# EAGLE design tinyisp-v0.9 (EAGLE 6.3)
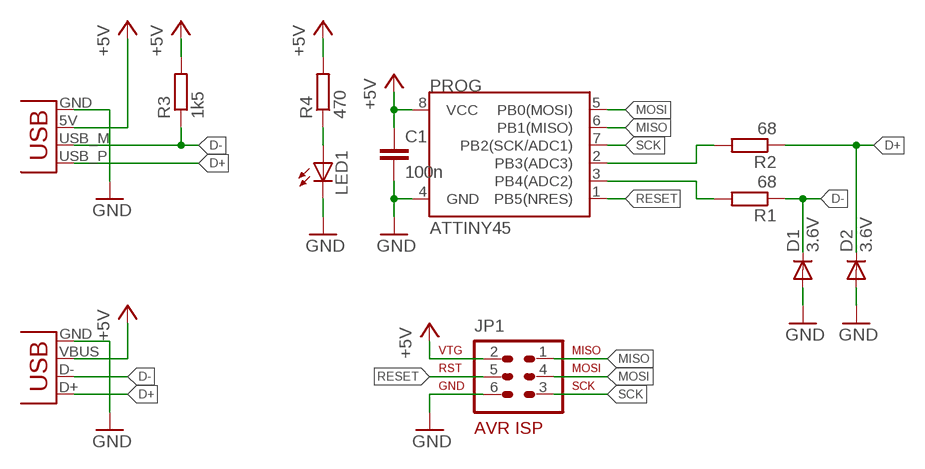
[diagram p0: schematic, sheet 1]

## Parts
C1  100n  C-EUC0805  [C0805]
D1  3.6V  DIODE-MINIMELF  [MINIMELF]
D2  3.6V  DIODE-MINIMELF  [MINIMELF]
JP1  AVR-ISP-6  [AVR-ISP-6]
LED1  LEDCHIP-LED0805  [CHIP-LED0805]
PROG  ATTINY45  [SO08-EIAJ]
R1  68  R-EU_R0805  [R0805]
R2  68  R-EU_R0805  [R0805]
R3  1k5  R-EU_R0805  [R0805]
R4  470  R-EU_R0805  [R0805]
X1  USBPCB  [USB-A-PCB]
X2  USBMINI_B_NOHOLES  [USB_MINI_B_NOHOLES]

## Nets
+5V: C1.1 JP1.2 PROG.8(VCC) R3.2 R4.2 X1.5V(VBUS) X2.VBUS
D+: D2.C R2.1 X1.USB_P(D+) X2.D+
D-: D1.C R1.1 R3.1 X1.USB_M(D-) X2.D-
GND: C1.2 D1.A D2.A JP1.6 LED1.C PROG.4(GND) X1.GND X2.GND
MISO: JP1.1 PROG.6(PB1(MISO))
MOSI: JP1.4 PROG.5(PB0(MOSI))
N$1: LED1.A R4.1
N$8: PROG.2(PB3(ADC3)) R2.2
N$9: PROG.3(PB4(ADC2)) R1.2
RESET: JP1.5 PROG.1(PB5(NRES))
SCK: JP1.3 PROG.7(PB2(SCK/ADC1))

## Library data of the parts
C1 = rcl:C-EU: CAPACITOR, European symbol
D1 D2 = diode:DIODE-: DIODE
JP1 = avr-6:AVR-ISP-6: AVR ISP-6 Serial Programming Header
LED1 = led:LED: LED OSRAM: - CHIPLED LG R971, LG N971, LY N971, LG Q971, LY Q971, LO R971, LY R971 LH N974, LH R974 LS Q976, LO Q976, LY Q976 LO Q996 - Hyper CHIPLED LW Q18S LB Q993, LB Q99A, LB R99A - SideLED LS A670, LO A670, LY A670, LG A670, LP A670 LB A673, LV A673, LT A673, LW A673 LH A674 LY A675 LS A676, LA A676, LO A676, LY A676, LW A676 LS A679, LY A679, LG A679 - Hyper Micro SIDELED® LS Y876, LA Y876, LO Y876, LY Y876 LT Y87S - SmartLED LW L88C, LW L88S LB L89C, LB L89S, LG L890 LS L89K, LO L89K, LY L89K LS L896, LA L896, LO L896, LY L896 - TOPLED LS T670, LO T670, LY T670, LG T670, LP T670 LSG T670, LSP T670, LSY T670, LOP T670, LYG T670 LG T671, LOG T671, LSG T671 LB T673, LV T673, LT T673, LW T673 LH T674 LS T676, LA T676, LO T676, LY T676, LB T676, LH T676, LSB T676, LW T676 LB T67C, LV T67C, LT T67C, LS T67K, LO T67K, LY T67K, LW E67C LS E67B, LA E67B, LO E67B, LY E67B, LB E67C, LV E67C, LT E67C LW T67C LS T679, LY T679, LG T679 LS T770, LO T770, LY T770, LG T770, LP T770 LB T773, LV T773, LT T773, LW T773 LH T774 LS E675, LA E675, LY E675, LS T675 LS T776, LA T776, LO T776, LY T776, LB T776 LHGB T686 LT T68C, LB T68C - Hyper Mini TOPLED® LB M676 - Mini TOPLED Santana® LG M470 LS M47K, LO M47K, LY M47K Source: http://www.osram.convergy.de LUXEON: - LUMILED® LXK2-PW12-R00, LXK2-PW12-S00, LXK2-PW14-U00, LXK2-PW14-V00 LXK2-PM12-R00, LXK2-PM12-S00, LXK2-PM14-U00 LXK2-PE12-Q00, LXK2-PE12-R00, LXK2-PE12-S00, LXK2-PE14-T00, LXK2-PE14-U00 LXK2-PB12-K00, LXK2-PB12-L00, LXK2-PB12-M00, LXK2-PB14-N00, LXK2-PB14-P00, LXK2-PB14-Q00 LXK2-PR12-L00, LXK2-PR12-M00, LXK2-PR14-Q00, LXK2-PR14-R00 LXK2-PD12-Q00, LXK2-PD12-R00, LXK2-PD12-S00 LXK2-PH12-R00, LXK2-PH12-S00 LXK2-PL12-P00, LXK2-PL12-Q00, LXK2-PL12-R00 Source: www.luxeon.com KINGBRIGHT: KA-3528ASYC Source: www.kingbright.com
PROG = SparkFun:ATTINY45: Atmel ATTiny45
R1-R4 = rcl:R-EU_: RESISTOR, European symbol
X1 = SparkFun:USB: USB Connectors USB-B-PTH is fully proven SKU : PRT-00139 USB-miniB is fully proven SKU : PRT-00587 USB-A-PCB is untested. USB-A-H is throughly reviewed, but untested. Spark Fun Electronics SKU : PRT-00437 USB-B-SMT is throughly reviewed, but untested. Needs silkscreen touching up. USB-A-S has not been used/tested USB-MB-H has not been used/tested
X2 = ppeter:USB

## Board
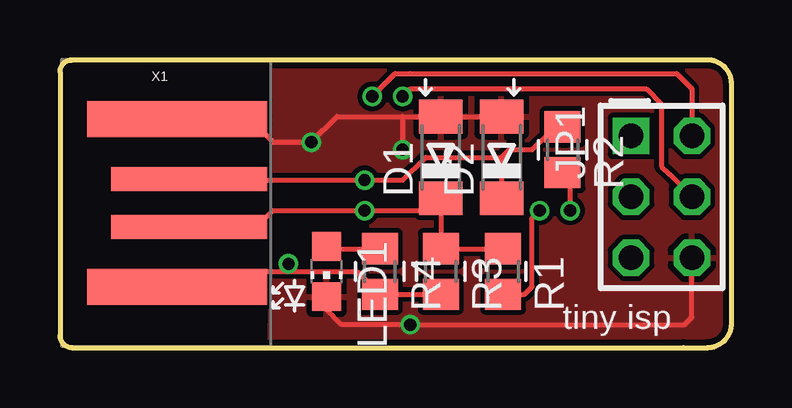
[diagram p1: board, top side]
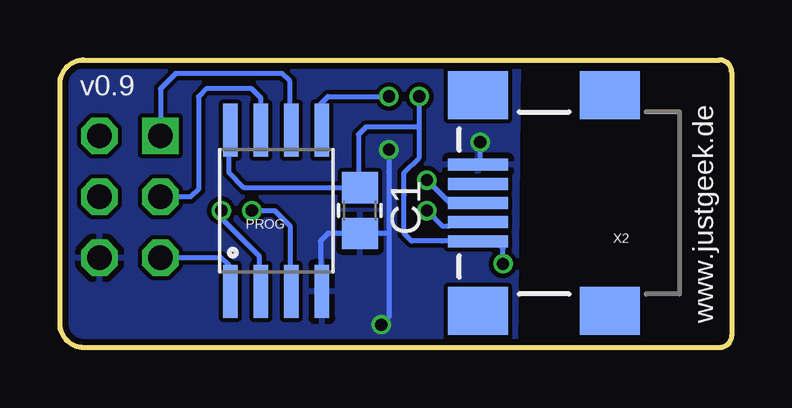
[diagram p2: board, bottom side, seen from below]

Size 28 x 12 mm. Coordinates in mm from the lower left corner, seen from the top.
Outline: 0.5,0 26,0 27,0 arc90 28,1 28,11 arc90 27,12 0.5,12 arc90 0,11.5 0,0.5 arc90 0.5,0
Copper layers (1*16): Top 0.035mm / dielectric 1.5mm / Bottom 0.035mm
Design rules "default": minimum track width 6mil, minimum drill 12mil, track to track 6mil, track to pad 6mil, pad to pad 6mil, via to via 6mil, smd to smd 0mil, copper to edge 10mil, drill to drill 10mil, minimum pad ring 10mil, minimum via ring 6mil, stop-mask expansion 2mil, vias tented up to drill 100mil, thermal gap 10mil

### Footprints (pad centres in the part's own frame; a part is rotated, then mirrored left to right if it is on the bottom)
C0805 = smd 1.3 x 1.5: 1 -0.95,0; 2 0.95,0
MINIMELF = smd 1.4 x 1.8: A 1.7,0; C -1.7,0
AVR-ISP-6 = drill 1.016 square: 1 -2.54,-1.27 | drill 1.016 octagon: 2 -2.54,1.27; 3 0,-1.27; 4 0,1.27; 5 2.54,-1.27; 6 2.54,1.27
CHIP-LED0805 = smd 1.2 x 1.2: A 0,-1.05; C 0,1.05
SO08-EIAJ = smd 0.61 x 2.21: 1 -1.905,-3.378; 2 -0.635,-3.378; 3 0.635,-3.378; 4 1.905,-3.378; 5 1.905,3.353; 6 0.635,3.353; 7 -0.635,3.353; 8 -1.905,3.353
R0805 = smd 1.3 x 1.5: 1 -0.95,0; 2 0.95,0
USB-A-PCB = smd 7.5 x 1.5: 5V -0.2,-3.5; GND -0.2,3.5 | smd 6.5 x 1: USB_M 0.3,-1; USB_P 0.3,1
USB_MINI_B_NOHOLES = smd 2.5 x 0.5: D+ 3.77,0; D- 3.77,0.8; GND 3.77,-1.6; ID 3.77,-0.8; VBUS 3.77,1.6 | smd 2.5 x 2: GND@1 -1.73,-4.5; GND@2 -1.73,4.5; GND@3 3.77,4.5; GND@4 3.77,-4.5

### Placement (x,y rotation side)
C1  15.49,5.71 270 bottom
D1  15.88,7.94 90 top
D2  18.41,7.94 90 top
JP1  25.08,6.29 270 top
LED1  11.11,3.17 180 top
PROG  18.99,5.71 0 bottom
R1  18.48,3.17 270 top
R2  20.95,8.26 270 top
R3  15.88,3.17 270 top
R4  13.34,3.17 270 top
X1  5.08,6.03 0 top
X2  6.79,6.03 180 bottom

### Tracks (layer width: path | path; a pad name or v marks a point on that pad's centre or on a via)
+5V  (via drill 0.51)
  Top 0.203: JP1.2 26.35,10.79 25.72,11.43 14.61,11.43 13.97,11.43 v13.02,10.48 | 8.26,3.17 9.53,3.17 | 9.53,3.17 9.84,3.17 12.38,3.17 12.7,2.86 R4.2 | 8.26,3.17 8.57,3.17 8.26,3.17 | 8.26,3.17 7.94,3.17 7.3,2.54 X1.5V | R3.2 15.55,2.23 15.24,2.22 R4.2 | R4.2 | 9.53,3.17 v9.53,3.49
  Bottom 0.203: C1.1 20.32,6.67 20.95,7.3 20.95,9 PROG.8 | C1.1 | C1.1 15.24,6.99 15.24,6.67 15.56,6.67 15.56,8.89 15.24,9.21 13.02,9.21 | C1.1 | 9.84,4.45 9.53,4.45 | 9.84,4.45 10.26,4.45 X2.VBUS 10.49,4.43 10.48,4.45 11.75,4.45 12.06,4.45 13.34,4.45 13.65,4.76 13.65,6.35 13.65,7.3 13.02,7.94 13.02,9.21 | 13.02,9.21 v13.02,10.48 | v9.53,3.49 9.53,4.13 9.84,4.45
D+  (via drill 0.51)
  Top 0.203: X1.USB_P 5.67,7.03 5.71,6.99 7.62,6.99 11.11,6.99 11.75,6.99 12.06,6.99 v12.7,6.99 14.29,6.99 15.24,7.94 18.41,7.94 | 18.41,7.94 D2.C | 18.41,7.94 18.73,8.26 19.68,8.26 20.32,8.89 R2.1
  Bottom 0.203: X2.D+ 11.75,6.03 v12.7,6.99
D-  (via drill 0.51)
  Top 0.203: X1.USB_M 5.38,5.06 5.4,5.08 8.26,5.08 8.89,5.71 v12.7,5.71 15.88,5.71 | 15.88,5.71 15.88,4.44 | 15.88,5.71 D1.C | 15.88,4.44 R3.1 | R3.1 R1.1 | R3.1 15.88,4.44 | 15.88,4.44 15.88,4.45
  Bottom 0.203: X2.D- 11.6,5.23 11.75,5.08 12.06,5.08 v12.7,5.71
GND  (via drill 0.51)
  Top 0.203: X1.GND | D2.A D1.A 14.29,9.64 | X1.GND 7.94,9.53 8.26,9.21 8.89,8.57 v10.48,8.57 11.54,9.64 14.29,9.64 | 14.29,9.64 v14.29,8.26 | LED1.C 11.11,1.59 11.75,0.95 13.97,0.95 v14.61,0.95 26.04,0.95 26.35,1.27 JP1.6
  Bottom 0.203: 15.55,4.76 15.56,4.76 | 10.49,7.63 X2.GND | 10.49,7.63 10.48,7.62 | C1.2 | C1.2 15.55,4.76 | 15.55,4.76 16.82,4.76 17.14,4.45 17.14,2.4 PROG.4 | 10.49,7.63 v10.49,8.56 v10.48,8.57 | C1.2 14.92,4.76 14.29,4.76 | 14.29,4.76 14.29,7.3 v14.29,8.26 | v14.61,0.95 14.29,1.27 14.29,4.76 | C1.2 15.55,4.76
  pour Bottom (isolate 0.178): 27.94,0 28.26,12.06 8.89,12.06 9.02,-0.06
  pour Top (isolate 0.203): 8.76,0 8.89,12.06 27.94,12.06 27.94,0
MISO
  Bottom 0.203: PROG.6 18.41,9.13 18.41,11.11 18.73,11.43 23.18,11.43 23.81,10.79 JP1.1
MOSI  (via drill 0.51)
  Top 0.203: JP1.4 25.4,7.24 25.08,7.56 25.08,10.16 24.45,10.79 14.61,10.79 v14.29,10.48
  Bottom 0.203: 17.14,8.89 17.14,9.07 PROG.5 17.08,9.78 17.14,9.84 17.14,10.16 16.83,10.48 v14.29,10.48
N$1
  Top 0.203: 11.21,4.12 LED1.A 11.21,4.12 | 11.21,4.12 R4.1
N$8  (via drill 0.51)
  Top 0.203: v21.27,5.71 21.27,7.3 R2.2
  Bottom 0.203: 19.68,2.4 PROG.2 19.68,2.4 | 19.68,2.4 19.68,3.17 19.68,3.81 20,4.13 20.64,4.76 21.27,5.4 v21.27,5.71
N$9  (via drill 0.51)
  Top 0.203: v20,5.71 19.68,5.4 19.68,2.54 19.37,2.22 18.16,2.22 R1.2
  Bottom 0.203: PROG.3 18.35,3.11 18.41,3.17 18.41,5.08 19.05,5.71 v20,5.71
RESET
  Bottom 0.203: JP1.5 21.27,3.75 20.95,3.43 20.95,2.4 PROG.1
SCK
  Bottom 0.203: PROG.7 19.62,10.41 20,10.79 21.91,10.79 22.23,10.48 22.23,6.6 22.54,6.29 JP1.3

### Text on the board
tPlace: tiny isp
bPlace: v0.9 | www.justgeek.de